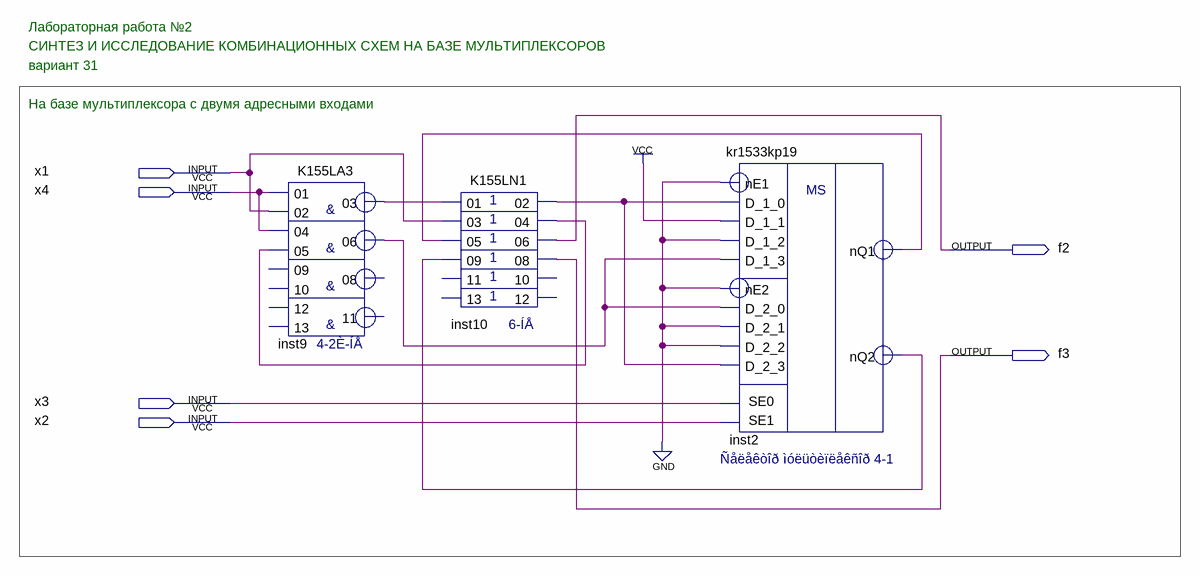
[diagram p0: schematic sheet]
// Quartus schematic MUX_with_2_adress_input.bdf as structural Verilog: 3 symbols, 6 pins
module MUX_with_2_adress_input (
  input  x1,
  input  x4,
  input  x3,
  input  x2,
  output f2,
  output f3
);

  wire inst2_nq1, inst2_nq2, inst9_03, inst9_06, inst10_02, inst10_04;

  K155LA3 inst9 (
    .\01 (x4), .\02 (x1), .\04 (x4), .\05 (inst10_04), .\03 (inst9_03), .\06 (inst9_06));  // open: 09, 10, 12, 13, 08, 11
  K155LN1 inst10 (
    .\01 (inst9_03), .\03 (x1), .\05 (inst2_nq1), .\09 (inst2_nq2), .\02 (inst10_02), .\04 (inst10_04),
    .\06 (f2), .\08 (f3));  // open: 11, 13, 10, 12
  kr1533kp19 inst2 (
    .nE1(1'b0), .D_1_0(inst10_02), .D_1_1(1'b1), .D_1_2(1'b0), .D_1_3(inst9_06), .SE1(x2), .SE0(x3),
    .D_2_0(inst9_06), .D_2_1(1'b0), .D_2_2(1'b0), .D_2_3(inst10_02), .nE2(1'b0), .nQ1(inst2_nq1),
    .nQ2(inst2_nq2));

  // Notes on the sheet:
  //   Лабораторная работа №2
  //   СИНТЕЗ И ИССЛЕДОВАНИЕ КОМБИНАЦИОННЫХ СХЕМ НА БАЗЕ МУЛЬТИПЛЕКСОРОВ
  //   вариант 31
  //   На базе мультиплексора с двумя адресными входами
endmodule
